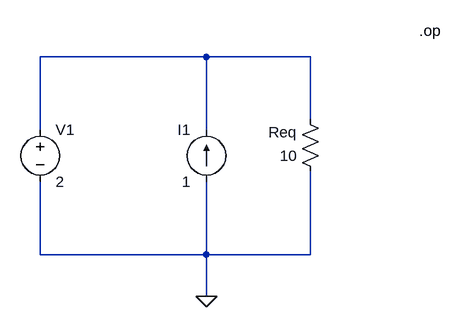
[diagram p0: schematic simplifié.asc]
simplifié.asc, the LTspice schematic file:
Version 4
SHEET 1 880 680
WIRE 256 160 0 160
WIRE 416 160 256 160
WIRE 416 256 416 160
WIRE 0 272 0 160
WIRE 256 272 256 160
WIRE 0 464 0 352
WIRE 256 464 256 352
WIRE 256 464 0 464
WIRE 416 464 416 336
WIRE 416 464 256 464
WIRE 256 528 256 464
FLAG 256 528 0
SYMBOL current 256 352 R180
WINDOW 0 24 80 Left 2
WINDOW 3 24 0 Left 2
SYMATTR InstName I1
SYMATTR Value 1
SYMBOL voltage 0 256 R0
WINDOW 123 0 0 Left 0
WINDOW 39 0 0 Left 0
SYMATTR InstName V1
SYMATTR Value 2
SYMBOL res 432 352 R180
WINDOW 0 36 76 Left 2
WINDOW 3 36 40 Left 2
SYMATTR InstName Req
SYMATTR Value 10
TEXT 584 120 Left 2 !.op

The netlist it stands for:
* simplifié.asc
I1 0 N001 1
V1 N001 0 2
Req 0 N001 10
.op
.backanno
.end